# EAGLE board InkTime_Schematic (EAGLE 9.7.0)
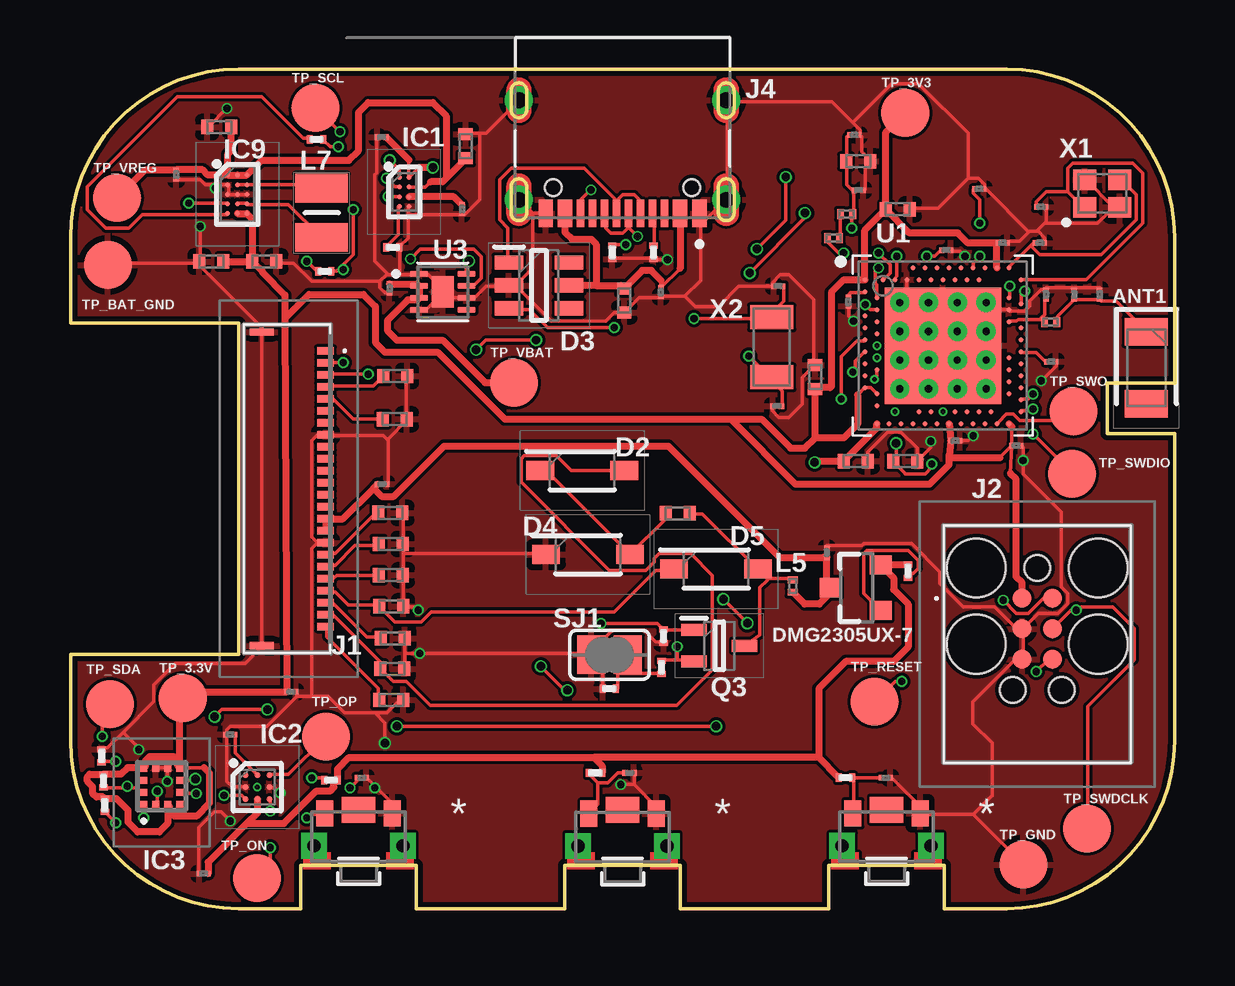
[diagram p2: board, top side]
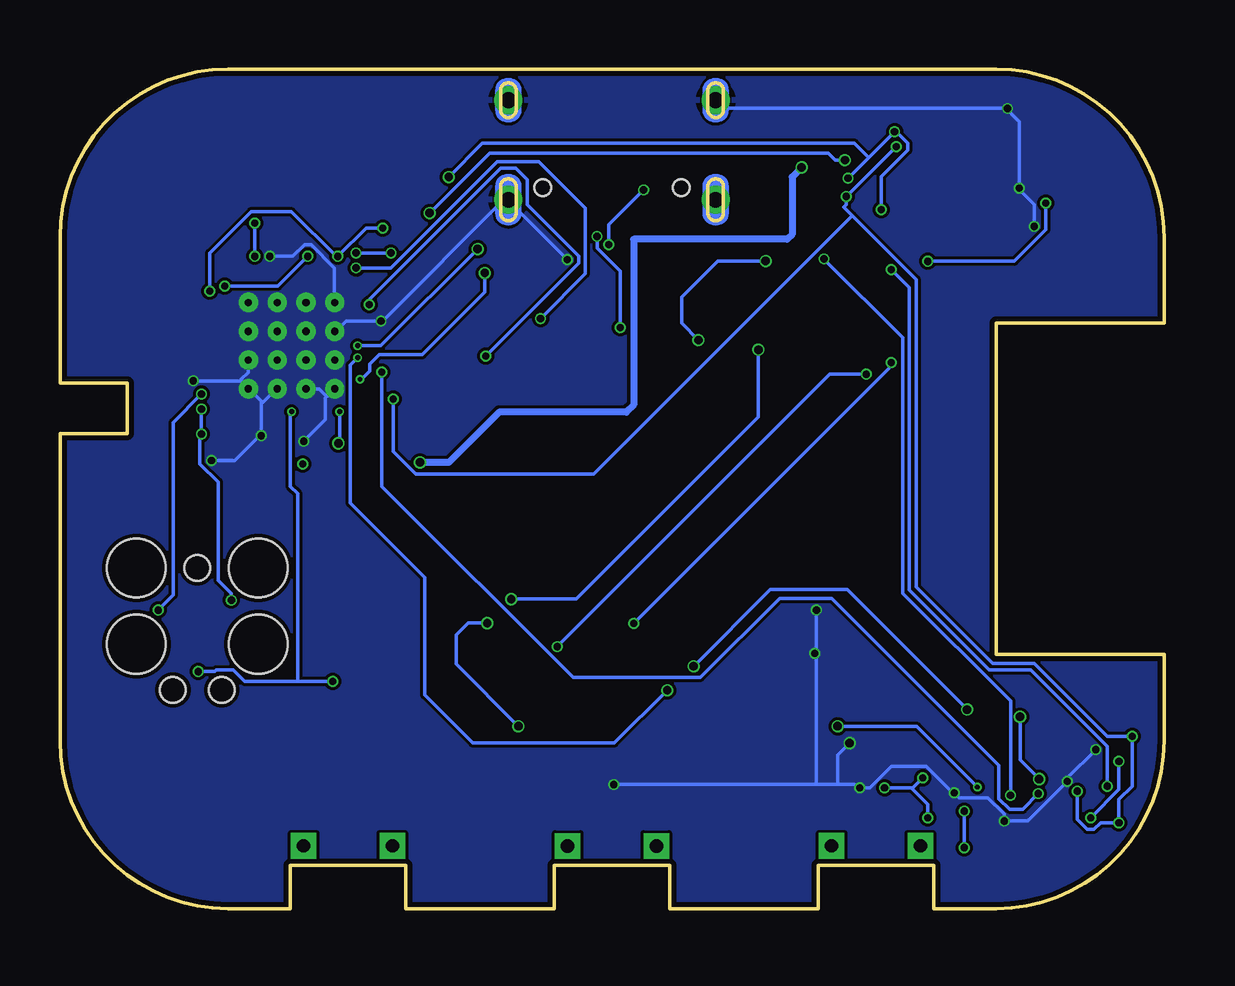
[diagram p3: board, bottom side, seen from below]

Size 46 x 35 mm. Coordinates in mm from the lower left corner, seen from the top.
Outline: 18.36,29 18.36,30.1 18.36,30.13 18.36,30.16 18.37,30.18 18.38,30.21 18.38,30.24 18.4,30.26 18.41,30.29 18.43,30.31 18.45,30.33 18.47,30.35 18.49,30.37 18.52,30.38 18.54,30.39 18.57,30.41 18.6,30.41 18.62,30.42 18.65,30.42 18.68,30.43 18.71,30.42 18.74,30.42 18.76,30.41 18.79,30.41 18.82,30.39 18.84,30.38 18.87,30.37 18.89,30.35 18.91,30.33 18.93,30.31 18.95,30.29 18.96,30.26 18.98,30.24 18.98,30.21 18.99,30.18 19,30.16 19,30.13 19,30.1 19,29 19,28.97 19,28.94 18.99,28.92 18.98,28.89 18.98,28.86 18.96,28.84 18.95,28.81 18.93,28.79 18.91,28.77 18.89,28.75 18.87,28.73 18.84,28.72 18.82,28.7 18.79,28.7 18.76,28.69 18.74,28.68 18.71,28.68 18.68,28.68 18.65,28.68 18.62,28.68 18.6,28.69 18.57,28.7 18.54,28.7 18.52,28.72 18.49,28.73 18.47,28.75 18.45,28.77 18.43,28.79 18.41,28.81 18.4,28.84 18.38,28.86 18.38,28.89 18.37,28.92 18.36,28.94 18.36,28.97 18.36,29
Outline: 27,33.3 27,34.1 27,34.13 27,34.16 27.01,34.18 27.02,34.21 27.02,34.24 27.04,34.26 27.05,34.29 27.07,34.31 27.09,34.33 27.11,34.35 27.13,34.37 27.16,34.38 27.18,34.39 27.21,34.41 27.24,34.41 27.26,34.42 27.29,34.42 27.32,34.42 27.35,34.42 27.38,34.42 27.4,34.41 27.43,34.41 27.46,34.39 27.48,34.38 27.51,34.37 27.53,34.35 27.55,34.33 27.57,34.31 27.59,34.29 27.6,34.26 27.62,34.24 27.62,34.21 27.63,34.18 27.64,34.16 27.64,34.13 27.64,34.1 27.64,33.3 27.64,33.27 27.64,33.24 27.63,33.22 27.62,33.19 27.62,33.16 27.6,33.14 27.59,33.11 27.57,33.09 27.55,33.07 27.53,33.05 27.51,33.03 27.48,33.02 27.46,33.01 27.43,32.99 27.4,32.99 27.38,32.98 27.35,32.98 27.32,32.98 27.29,32.98 27.26,32.98 27.24,32.99 27.21,32.99 27.18,33.01 27.16,33.02 27.13,33.03 27.11,33.05 27.09,33.07 27.07,33.09 27.05,33.11 27.04,33.14 27.02,33.16 27.02,33.19 27.01,33.22 27,33.24 27,33.27 27,33.3
Outline: 18.36,33.3 18.36,34.1 18.36,34.13 18.36,34.16 18.37,34.18 18.38,34.21 18.38,34.24 18.4,34.26 18.41,34.29 18.43,34.31 18.45,34.33 18.47,34.35 18.49,34.37 18.52,34.38 18.54,34.39 18.57,34.41 18.6,34.41 18.62,34.42 18.65,34.42 18.68,34.42 18.71,34.42 18.74,34.42 18.76,34.41 18.79,34.41 18.82,34.39 18.84,34.38 18.87,34.37 18.89,34.35 18.91,34.33 18.93,34.31 18.95,34.29 18.96,34.26 18.98,34.24 18.98,34.21 18.99,34.18 19,34.16 19,34.13 19,34.1 19,33.3 19,33.27 19,33.24 18.99,33.22 18.98,33.19 18.98,33.16 18.96,33.14 18.95,33.11 18.93,33.09 18.91,33.07 18.89,33.05 18.87,33.03 18.84,33.02 18.82,33.01 18.79,32.99 18.76,32.99 18.74,32.98 18.71,32.98 18.68,32.98 18.65,32.98 18.62,32.98 18.6,32.99 18.57,32.99 18.54,33.01 18.52,33.02 18.49,33.03 18.47,33.05 18.45,33.07 18.43,33.09 18.41,33.11 18.4,33.14 18.38,33.16 18.38,33.19 18.37,33.22 18.36,33.24 18.36,33.27 18.36,33.3
Outline: 27,29 27,30.1 27,30.13 27,30.16 27.01,30.18 27.02,30.21 27.02,30.24 27.04,30.26 27.05,30.29 27.07,30.31 27.09,30.33 27.11,30.35 27.13,30.37 27.16,30.38 27.18,30.39 27.21,30.41 27.24,30.41 27.26,30.42 27.29,30.42 27.32,30.43 27.35,30.42 27.38,30.42 27.4,30.41 27.43,30.41 27.46,30.39 27.48,30.38 27.51,30.37 27.53,30.35 27.55,30.33 27.57,30.31 27.59,30.29 27.6,30.26 27.62,30.24 27.62,30.21 27.63,30.18 27.64,30.16 27.64,30.13 27.64,30.1 27.64,29 27.64,28.97 27.64,28.94 27.63,28.92 27.62,28.89 27.62,28.86 27.6,28.84 27.59,28.81 27.57,28.79 27.55,28.77 27.53,28.75 27.51,28.73 27.48,28.72 27.46,28.7 27.43,28.7 27.4,28.69 27.38,28.68 27.35,28.68 27.32,28.68 27.29,28.68 27.26,28.68 27.24,28.69 27.21,28.7 27.18,28.7 27.16,28.72 27.13,28.73 27.11,28.75 27.09,28.77 27.07,28.79 27.05,28.81 27.04,28.84 27.02,28.86 27.02,28.89 27.01,28.92 27,28.94 27,28.97 27,29
Outline: 0,10.6 0,7 arc90 7,0 9.6,0 9.6,1.8 14.4,1.8 14.4,0 20.6,0 20.6,1.8 25.4,1.8 25.4,0 31.6,0 31.6,1.8 36.4,1.8 36.4,0 39,0 arc90 46,7 46,19.8 43.2,19.8 43.2,21.9 46,21.9 46,28 arc90 39,35 7,35 arc90 0,28 0,24.4 7,24.4 7,10.6 0,10.6
Copper layers (1*16): Top 0.035mm / dielectric 1.6mm / Bottom 0.035mm
Design rules "jlcpcb-2layers.dru *": minimum track width 5mil, minimum drill 0.3mm, track to track 5mil, track to pad 5mil, pad to pad 5mil, via to via 5mil, smd to smd 5mil, copper to edge 0.2mm, drill to drill 6mil, minimum pad ring 10mil, minimum via ring 3mil, stop-mask expansion 4mil, vias tented up to drill 0mil, thermal gap 10mil
Net classes: 0 default: width 0.15 mm; 1 traseedeputere: width 0.3 mm

## Footprints (pad centres in the part's own frame; a part is rotated, then mirrored left to right if it is on the bottom)
2450AT18B100E_ANTC3216X140N = smd 1.15 x 1.8: 1 -1.5,0; 2 1.5,0
GRM011R60J152KE01L_2_CAPC0201X13N = smd 0.22 x 0.23: 1 -0.185,0; 2 0.185,0
NORDIC_NRF_3_RESC0402_L = smd 0.5 x 0.6: 1 -0.5,0; 2 0.5,0
ESP32_C6_LIBRARY_5_SOD3716X135N = smd 1.15 x 0.8: 1 -1.75,0; 2 1.75,0
ESP32_C6_LIBRARY_3_SOT95P280X145-6N = smd 1.2 x 0.6: 1 -1.25,0.95; 2 -1.25,0; 3 -1.25,-0.95; 4 1.25,-0.95; 5 1.25,0; 6 1.25,0.95
ESP32_C6_LIBRARY_4_ESP32_C6_LIBRARY_4_ESP32_C6_LIBRARY_4_ESP32_C6_LIBRARY_4_ESP32_WROVER_SPARKFUN-DISCRETESEMI_SOT23-3 = smd 0.8 x 0.9: 1 -0.95,-1; 2 0.95,-1; 3 0,1.1
BQ25180YBGR_BGA8C40P2X4_100X155X50 = smd 0.2 x 0.2: A1 -0.2,0.6; A2 0.2,0.6; B1 -0.2,0.2; B2 0.2,0.2; C1 -0.2,-0.2; C2 0.2,-0.2; D1 -0.2,-0.6; D2 0.2,-0.6
DRV2605YZFR_BGA9C50P3X3_144X144X62 = smd 0.25 x 0.25: A1 -0.5,0.5; A2 0,0.5; A3 0.5,0.5; B1 -0.5,0; B2 0,0; B3 0.5,0; C1 -0.5,-0.5; C2 0,-0.5; C3 0.5,-0.5
BMA423_BMA423 = smd 0.3 x 0.35: 1 -0.75,-0.775; 2 -0.25,-0.775; 3 0.25,-0.775; 4 0.75,-0.775; 7 0.75,0.775; 8 0.25,0.775; 9 -0.25,0.775; 10 -0.75,0.775 | smd 0.35 x 0.3: 5 0.775,-0.25; 6 0.775,0.25; 11 -0.775,0.25; 12 -0.775,-0.25
RT6160AWSC_BGA15C40P3X5_140X230X60 = smd 0.216 x 0.216: A1 -0.4,0.8; A2 0,0.8; A3 0.4,0.8; B1 -0.4,0.4; B2 0,0.4; B3 0.4,0.4; C1 -0.4,0; C2 0,0; C3 0.4,0; D1 -0.4,-0.4; D2 0,-0.4; D3 0.4,-0.4; E1 -0.4,-0.8; E2 0,-0.8; E3 0.4,-0.8
503480-2400_5034802400 = smd 0.3 x 0.7: 1 -5.75,1.525; 2 -5.25,1.525; 3 -4.75,1.525; 4 -4.25,1.525; 5 -3.75,1.525; 6 -3.25,1.525; 7 -2.75,1.525; 8 -2.25,1.525; 9 -1.75,1.525; 10 -1.25,1.525; 11 -0.75,1.525; 12 -0.25,1.525; 13 0.25,1.525; 14 0.75,1.525; 15 1.25,1.525; 16 1.75,1.525; 17 2.25,1.525; 18 2.75,1.525; 19 3.25,1.525; 20 3.75,1.525; 21 4.25,1.525; 22 4.75,1.525; 23 5.25,1.525; 24 5.75,1.525 | smd 0.3 x 1: MP1 -6.54,-1.125; MP2 6.54,-1.125
TC2030-IDC_TC2030IDC = smd 0.783 x 0.783: 1 -0.953,-0.635; 2 -0.953,0.635; 3 0.317,-0.635; 4 0.317,0.635; 5 1.588,-0.635; 6 1.588,0.635 | hole 2.451: -2.223,-2.54; -2.223,2.54; 0.952,-2.54; 0.952,2.54 | hole 1.067: -2.223,0; 2.857,-1.016; 2.857,1.016
KH-TYPE-C-16P_KINGHELM_KH-TYPE-C-16P = smd 0.6 x 1.15: A1_B12 -3.2,4.725; A4_B9 -2.4,4.725; A9_B4 2.4,4.725; A12_B1 3.2,4.725 | smd 0.3 x 1.15: A5 -1.25,4.725; A6 -0.25,4.725; A7 0.25,4.725; A8 1.25,4.725; B5 1.75,4.725; B6 0.75,4.725; B7 -0.75,4.725; B8 -1.75,4.725 | drill 0.65 pad 1.05: SH1 -4.32,0; SH2 4.32,0; SH3 -4.32,4.15; SH4 4.32,4.15 | hole 0.7: -2.89,3.65; 2.89,3.65
NORDIC_NRF_2_RESC0201_L = smd 0.28 x 0.43: 1 -0.255,0; 2 0.255,0
MLP2016SR47MT0S1_INDC2016X100N = smd 1.2 x 2.2: 1 -1.028,0; 2 1.028,0
ESP32_C6_LIBRARY_6_SOT65P210X110-3N = smd 1.05 x 0.5: 1 -1.05,0.65; 2 -1.05,-0.65; 3 1.05,0
CPF0201D7K68C1_0201 = smd 0.35 x 0.25: 1 0,0.275; 2 0,-0.275
ESP32_C6_LIBRARY_7_JUMPER_SJ = smd 1.168 x 1.6: 1 -0.762,0; 2 0.762,0
2025-10-22_07-23-44_LIBRARY_SW_EVP-AKE31A_PAN = smd 0.711 x 1.092: 1 -1.4,-0.972; 2 1.4,-0.972 | drill 0.559 pad 0.914 square: 3 -1.848,0.381; 4 1.848,0.381 | smd 1.397 x 1.092: 5 0,-1.124
HECTOR_WATCH_1_TP20R = smd 2 x 2: TP 0,0
NORDIC_NRF_4_AQFN50P700X700X85_HS-74N = smd 4.85 x 4.85: P$74 0,0 | drill 0.3 pad 0.6: P$75 -1.8,1.8; P$76 -0.6,1.8; P$77 0.6,1.8; P$78 1.8,1.8; P$79 -1.8,0.6; P$80 -0.6,0.6; P$81 0.6,0.6; P$82 1.8,0.6; P$83 -1.8,-0.6; P$84 -0.6,-0.6; P$85 0.6,-0.6; P$86 1.8,-0.6; P$87 -1.8,-1.8; P$88 -0.6,-1.8; P$89 0.6,-1.8; P$90 1.8,-1.8 | smd 0.2 x 0.2: P$A8 -1.25,3.25; P$A10 -0.75,3.25; P$A12 -0.25,3.25; P$A14 0.25,3.25; P$A16 0.75,3.25; P$A18 1.25,3.25; P$A20 1.75,3.25; P$A22 2.25,3.25; P$A23 2.75,3.25; P$AA24 3.25,-2.25; P$AB2 -2.75,-2.5; P$AC5 -2,-2.75; P$AC9 -1,-2.75; P$AC11 -0.5,-2.75; P$AC13 0,-2.75; P$AC15 0.5,-2.75; P$AC17 1,-2.75; P$AC19 1.5,-2.75; P$AC21 2,-2.75; P$AC24 3.25,-2.75; P$AD2 -2.75,-3.25; P$AD4 -2.25,-3.25; P$AD6 -1.75,-3.25; P$AD8 -1.25,-3.25; P$AD10 -0.75,-3.25; P$AD12 -0.25,-3.25; P$AD14 0.25,-3.25; P$AD16 0.75,-3.25; P$AD18 1.25,-3.25; P$AD20 1.75,-3.25; P$AD22 2.25,-3.25; P$AD23 2.75,-3.25; P$B1 -3.25,2.75; P$B3 -2.5,2.75; P$B5 -2,2.75; P$B7 -1.5,2.75; P$B9 -1,2.75; P$B11 -0.5,2.75; P$B13 0,2.75; P$B15 0.5,2.75; P$B17 1,2.75; P$B19 1.5,2.75; P$B24 3.25,2.75; P$C1 -3.25,2.25; P$D2 -2.75,2; P$D23 2.75,2; P$E24 3.25,1.75; P$F2 -2.75,1.5; P$F23 2.75,1.5; P$G1 -3.25,1.25; P$H2 -2.75,1; P$H23 2.75,1; P$J1 -3.25,0.75; P$J24 3.25,0.75; P$K2 -2.75,0.5; P$L1 -3.25,0.25; P$L24 3.25,0.25; P$M2 -2.75,0; P$N1 -3.25,-0.25; P$N24 3.25,-0.25; P$P2 -2.75,-0.5; P$P23 2.75,-0.5; P$R1 -3.25,-0.75; P$R24 3.25,-0.75; P$T2 -2.75,-1; P$T23 2.75,-1; P$U1 -3.25,-1.25; P$U24 3.25,-1.25; P$V23 2.75,-1.5; P$W1 -3.25,-1.75; P$W24 3.25,-1.75; P$Y2 -2.75,-2; P$Y23 2.75,-2
ESP32_C6_LIBRARY_SON50P200X200X80-9N = smd 0.76 x 0.27: 1 -0.985,0.75; 2 -0.985,0.25; 3 -0.985,-0.25; 4 -0.985,-0.75; 5 0.985,-0.75; 6 0.985,-0.25; 7 0.985,0.25; 8 0.985,0.75 | smd 0.9 x 1.3: 9 0,0
NORDIC_NRF_BT-XTAL_2016_N = smd 0.95 x 0.85: 1 -0.725,-0.575; 2 0.725,-0.575; 3 0.725,0.575; 4 -0.725,0.575
NORDIC_NRF_1_XTAL_3215_N = smd 1 x 1.8: 1 -1.25,0; 2 1.25,0

## Placement (x,y rotation side)
ANT1  2450AT18B100E  [2450AT18B100E_ANTC3216X140N]  44.82,22.55 270 top
C1  12pF  [GRM011R60J152KE01L_2_CAPC0201X13N]  40.44,29.25 0 top
C1-EP-DR  10uF  [GRM011R60J152KE01L_2_CAPC0201X13N]  31.51,14.84 90 top
C2  12pF  [GRM011R60J152KE01L_2_CAPC0201X13N]  40.39,27.75 0 top
C2-EP-DR  4.7uF/25V  [NORDIC_NRF_3_RESC0402_L]  25.3,16.48 0 top
C3  1pF  [GRM011R60J152KE01L_2_CAPC0201X13N]  40.64,25.6 90 top
C4  1pF  [GRM011R60J152KE01L_2_CAPC0201X13N]  41.82,25.6 90 top
C5  100nF  [GRM011R60J152KE01L_2_CAPC0201X13N]  32.41,25.3 270 top
C6  4.7uF  [NORDIC_NRF_3_RESC0402_L]  31.02,22.15 90 top
C7  100nF  [GRM011R60J152KE01L_2_CAPC0201X13N]  36.86,19.5 0 top
C8  100nF  [GRM011R60J152KE01L_2_CAPC0201X13N]  39.41,19.3 0 top
C9  820pF  [GRM011R60J152KE01L_2_CAPC0201X13N]  40.86,22.8 0 top
C10  N.C.  [GRM011R60J152KE01L_2_CAPC0201X13N]  32.66,32.25 0 top
C11  100pF  [GRM011R60J152KE01L_2_CAPC0201X13N]  36.49,27.45 0 top
C12  100nF  [GRM011R60J152KE01L_2_CAPC0201X13N]  38.84,27.75 0 top
C13  N.C.  [GRM011R60J152KE01L_2_CAPC0201X13N]  37.86,30 0 top
C14  4.7uF  [NORDIC_NRF_3_RESC0402_L]  34.47,29.15 0 top
C15  1.0uF  [NORDIC_NRF_3_RESC0402_L]  32.82,31.15 0 top
C16  47nF  [GRM011R60J152KE01L_2_CAPC0201X13N]  32.84,29.95 0 top
C17  12pF  [GRM011R60J152KE01L_2_CAPC0201X13N]  29.49,25.95 0 top
C18  12pF  [GRM011R60J152KE01L_2_CAPC0201X13N]  29.44,20.95 0 top
C19  100nF  [GRM011R60J152KE01L_2_CAPC0201X13N]  9.19,9.04 0 top
C20  4.7uF  [NORDIC_NRF_3_RESC0402_L]  34.77,18.65 0 top
C21  4.7uF  [NORDIC_NRF_3_RESC0402_L]  32.72,18.65 0 top
C22  N.C.  [GRM011R60J152KE01L_2_CAPC0201X13N]  42.88,25.6 90 top
C23  0.1uF  [GRM011R60J152KE01L_2_CAPC0201X13N]  4.4,30.6 90 top
C24  10uF  [NORDIC_NRF_3_RESC0402_L]  6.19,32.58 0 top
C25  22uF  [NORDIC_NRF_3_RESC0402_L]  8.08,26.98 0 top
C27  0.1uF  [GRM011R60J152KE01L_2_CAPC0201X13N]  13.29,25.86 90 top
C29  1uF  [GRM011R60J152KE01L_2_CAPC0201X13N]  33.97,5.46 180 top
C30  1uF  [GRM011R60J152KE01L_2_CAPC0201X13N]  12.13,5.46 180 top
C31  1uF  [GRM011R60J152KE01L_2_CAPC0201X13N]  23.29,5.66 180 top
C32  1uF  [GRM011R60J152KE01L_2_CAPC0201X13N]  6.65,7.26 0 top
C33  22uF  [NORDIC_NRF_3_RESC0402_L]  5.87,26.98 180 top
C34  0.1uF  [GRM011R60J152KE01L_2_CAPC0201X13N]  5.55,1.46 0 top
C37  1uF  [GRM011R60J152KE01L_2_CAPC0201X13N]  16.31,29.16 90 top
C38  1uF  [GRM011R60J152KE01L_2_CAPC0201X13N]  12.97,32.16 0 top
C39  10uF  [NORDIC_NRF_3_RESC0402_L]  16.46,31.78 90 top
C42  0.1uF  [GRM011R60J152KE01L_2_CAPC0201X13N]  24.6,25.7 270 top
C43  4.7uF  [NORDIC_NRF_3_RESC0402_L]  23.07,25.35 270 top
D2  MBR0530  [ESP32_C6_LIBRARY_5_SOD3716X135N]  21.32,18.26 0 top
D3  USBLC6-2SC6Y  [ESP32_C6_LIBRARY_3_SOT95P280X145-6N]  19.52,25.98 0 top
D4  MBR0530  [ESP32_C6_LIBRARY_5_SOD3716X135N]  21.56,14.76 0 top
D5  MBR0530  [ESP32_C6_LIBRARY_5_SOD3716X135N]  26.9,14.16 0 top
DMG2305UX-7  20V/4.2A/52mΩ/1.4W  [ESP32_C6_LIBRARY_4_ESP32_C6_LIBRARY_4_ESP32_C6_LIBRARY_4_ESP32_C6_LIBRARY_4_ESP32_WROVER_SPARKFUN-DISCRETESEMI_SOT23-3]  32.76,13.38 90 top
EPD_C1  1uF/50V  [NORDIC_NRF_3_RESC0402_L]  13.51,20.4 180 top
EPD_C2  1uF/50V  [NORDIC_NRF_3_RESC0402_L]  13.52,22.2 180 top
EPD_C5  0.1uF/50V  [GRM011R60J152KE01L_2_CAPC0201X13N]  12.98,17.7 180 top
EPD_C6  1uF/50V  [NORDIC_NRF_3_RESC0402_L]  13.33,16.5 180 top
EPD_C7  1uF/50V  [NORDIC_NRF_3_RESC0402_L]  13.34,15.2 180 top
EPD_C8  1uF/50V  [NORDIC_NRF_3_RESC0402_L]  13.35,13.9 180 top
EPD_C9  1uF/50V  [NORDIC_NRF_3_RESC0402_L]  13.36,12.6 180 top
EPD_C10  1uF/50V  [NORDIC_NRF_3_RESC0402_L]  13.42,11.27 180 top
EPD_C11  1uF/50V  [NORDIC_NRF_3_RESC0402_L]  13.4,10 180 top
EPD_C12  1uF/50V  [NORDIC_NRF_3_RESC0402_L]  13.36,8.7 180 top
IC1  BQ25180YBGR  [BQ25180YBGR_BGA8C40P2X4_100X155X50]  13.9,29.88 0 top
IC2  DRV2605YZFR  [DRV2605YZFR_BGA9C50P3X3_144X144X62]  7.78,5.07 0 top
IC3  BMA421  [BMA423_BMA423]  3.8,5.1 0 top
IC9  RT6160AWSC  [RT6160AWSC_BGA15C40P3X5_140X230X60]  6.95,29.78 0 top
J1  503480-2400  [503480-2400_5034802400]  9.1,17.5 270 top
J2  TC2030-IDC  [TC2030-IDC_TC2030IDC]  40.28,11.98 270 top
J4  KH-TYPE-C-16P  [KH-TYPE-C-16P_KINGHELM_KH-TYPE-C-16P]  23,33.7 180 top
L1  3.9nH  [NORDIC_NRF_2_RESC0201_L]  40.84,24.45 0 top
L2  10uH  [NORDIC_NRF_2_RESC0201_L]  31.79,27.95 0 top
L3  15nH  [NORDIC_NRF_2_RESC0201_L]  32.34,28.95 0 top
L5  68uH  [NORDIC_NRF_2_RESC0201_L]  30.09,13.45 90 top
L7  FTC252012SR47MBCA  [MLP2016SR47MT0S1_INDC2016X100N]  10.46,29.01 270 top
Q3  SI1308EDL-T1-GE3  [ESP32_C6_LIBRARY_6_SOT65P210X110-3N]  27.03,10.96 0 top
R1_EP_DR  0.47  [CPF0201D7K68C1_0201]  24.63,10.06 180 top
R1_USB  5K1  [CPF0201D7K68C1_0201]  24.29,27.36 180 top
R2  0  [CPF0201D7K68C1_0201]  10.25,32.06 270 top
R2_EP_DR  10K  [CPF0201D7K68C1_0201]  24.71,11.36 180 top
R2_USB  5K1  [CPF0201D7K68C1_0201]  22.57,27.36 0 top
R3  0  [CPF0201D7K68C1_0201]  1.3,6.37 0 top
R4  0  [CPF0201D7K68C1_0201]  10.59,26.56 270 top
R5  10K  [CPF0201D7K68C1_0201]  10.85,5.36 90 top
R7  10K  [CPF0201D7K68C1_0201]  32.29,5.46 270 top
R8  10K  [CPF0201D7K68C1_0201]  21.87,5.66 90 top
R9  10K  [CPF0201D7K68C1_0201]  13.43,27.56 270 top
R17  3K3  [CPF0201D7K68C1_0201]  1.37,5.33 0 top
R18  3K3  [CPF0201D7K68C1_0201]  1.43,4.3 0 top
R_PWR_EPD  10K  [CPF0201D7K68C1_0201]  34.89,14.07 180 top
R_TYPE_SEL  2.2  [CPF0201D7K68C1_0201]  22.45,9.17 90 top
SJ1  [ESP32_C6_LIBRARY_7_JUMPER_SJ]  22.46,10.58 0 top
SW_DN  2025-10-22_07-23-44_LIBRARY_EVP-AKE31ASW_EVP-AKE31A_PAN  [2025-10-22_07-23-44_LIBRARY_SW_EVP-AKE31A_PAN]  34,3 180 top
SW_ENT  2025-10-22_07-23-44_LIBRARY_EVP-AKE31ASW_EVP-AKE31A_PAN  [2025-10-22_07-23-44_LIBRARY_SW_EVP-AKE31A_PAN]  23,2.99 180 top
SW_UP  2025-10-22_07-23-44_LIBRARY_EVP-AKE31ASW_EVP-AKE31A_PAN  [2025-10-22_07-23-44_LIBRARY_SW_EVP-AKE31A_PAN]  12,3 180 top
TP_3.3V  HECTOR_WATCH_1_TPTP20R  [HECTOR_WATCH_1_TP20R]  4.68,8.78 0 top
TP_3V3  HECTOR_WATCH_1_TPTP20R  [HECTOR_WATCH_1_TP20R]  34.78,33.18 0 top
TP_BAT_GND  HECTOR_WATCH_1_TPTP20R  [HECTOR_WATCH_1_TP20R]  1.56,26.83 0 top
TP_GND  HECTOR_WATCH_1_TPTP20R  [HECTOR_WATCH_1_TP20R]  39.7,1.83 0 top
TP_ON  HECTOR_WATCH_1_TPTP20R  [HECTOR_WATCH_1_TP20R]  7.76,1.28 0 top
TP_OP  HECTOR_WATCH_1_TPTP20R  [HECTOR_WATCH_1_TP20R]  10.64,7.18 0 top
TP_RESET  HECTOR_WATCH_1_TPTP20R  [HECTOR_WATCH_1_TP20R]  33.5,8.63 0 top
TP_SCL  HECTOR_WATCH_1_TPTP20R  [HECTOR_WATCH_1_TP20R]  10.2,33.38 0 top
TP_SDA  HECTOR_WATCH_1_TPTP20R  [HECTOR_WATCH_1_TP20R]  1.64,8.52 0 top
TP_SWDCLK  HECTOR_WATCH_1_TPTP20R  [HECTOR_WATCH_1_TP20R]  42.36,3.33 0 top
TP_SWDIO  HECTOR_WATCH_1_TPTP20R  [HECTOR_WATCH_1_TP20R]  41.73,18.13 0 top
TP_SWO  HECTOR_WATCH_1_TPTP20R  [HECTOR_WATCH_1_TP20R]  41.79,20.73 0 top
TP_VBAT  HECTOR_WATCH_1_TPTP20R  [HECTOR_WATCH_1_TP20R]  18.48,21.93 0 top
TP_VREG  HECTOR_WATCH_1_TPTP20R  [HECTOR_WATCH_1_TP20R]  1.94,29.63 0 top
U1  NRF52840_QF  [NORDIC_NRF_4_AQFN50P700X700X85_HS-74N]  36.35,23.47 0 top
U3  MAX17048G+T10  [ESP32_C6_LIBRARY_SON50P200X200X80-9N]  15.51,25.71 0 top
X1  32MHz  [NORDIC_NRF_BT-XTAL_2016_N]  42.99,29.81 0 top
X2  32.768kHz  [NORDIC_NRF_1_XTAL_3215_N]  29.22,23.41 270 top

## Tracks (layer width: path | path; a pad name or v marks a point on that pad's centre or on a via)
3V3/1.7D
  Top 0.3: IC2.C2 7.78,3.98 7.35,3.55 | 7.35,3.55 5.73,1.94 C34.2 | 21.8,6.3 11.6,6.3 11.12,5.82 R5.2 10.98,5.21 10.98,5.07 10.81,4.91 10.24,4.91 8.88,3.55 7.35,3.55 | 21.8,6.3 22.14,5.96 R8.2 | R7.2 31.18,6.3 | 31.18,6.3 21.8,6.3 | R_PWR_EPD.2 33.77,14.35 DMG2305UX-7.2 34.3,13.79 34.3,13.3 34.9,12.7 34.9,10.9 34.3,10.3 32.3,10.3 31.18,9.18 31.18,6.3
3V3/2.4A
  Top 0.127: U1.P$AD14
  Top 0.15: 38.6,27.73 C12.1 | 39.16,18.14 C8.1 | U1.P$Y2 33.35,21.72 U1.P$W1 32.8,21.42 | 5.57,5.88 IC3.7 | 38.73,18.8 C8.1 | 39.23,20.09 C8.1
  Top 0.3: C25.1 7.58,28.75 IC9.E3 IC9.E2 | C33.1 C25.1 | C14.1 33.1,28.28 U1.P$B1 32.22,26.22 31.7,25.7 31.7,21.77 31.65,21.72 31.09,21.72 C6.1 31.02,19.62 | U1.P$A22 38.6,27.73 | C12.1 37.39,27.75 36.97,28.17 34.95,28.17 C14.1 | C14.1 33.97,32.37 TP_3V3.TP | J2.1 39.64,13.59 39.4,13.84 39.4,17.9 39.16,18.14 | U1.P$AD14 C7.1 36.61,18.89 | 36.61,18.89 36.7,18.8 38.73,18.8 | C25.1 8,26.56 8,26.52 8.94,25.58 8.94,24.6 | 8.94,24.6 C19.1 4.93,9.04 TP_3.3V.TP 4.55,8.65 IC3.7 4.48,5.95 4.48,6.16 4.32,6.33 3.29,6.33 3.12,6.16 3.12,5.95 IC3.10 2.38,5.88 2.1,5.6 R17.1 | R17.1 | R17.1 0.8,5.6 0.7,5.5 0.7,5.31 0.92,5.08 0.92,4.81 1.08,4.65 1.35,4.65 R18.1 1.92,4.58 2.4,4.1 2.4,3.6 2.8,3.2 3.7,3.2 4.05,3.55 IC3.3 4.12,4.25 4.12,4.04 4.29,3.87 5.27,3.87 5.8,4.4 5.8,5.64 5.57,5.88 | 27.5,20.4 18.1,20.4 15.3,23.2 13.1,23.2 12.7,23.6 12.7,25.1 12.2,25.6 9.94,25.6 8.94,24.6 | 27.5,20.4 28.8,20.4 30,19.2 30.6,19.2 31.02,19.62 | 27.5,20.4 30.2,17.7 35.8,17.7 36.61,18.5 36.61,18.89 | 32.8,21.42 32.8,20.2 32.22,19.62 31.02,19.62 | U1.P$AD23 39.23,20.09
DEC1
  Top 0.15: U1.P$C1 33.04,25.67 32.49,25.67 32.42,25.6 C5.1
DEC3  (via drill 0.3)
  Top 0.15: v39.14,25.95 39.14,25.53 U1.P$D23 | v35.67,27.2 36.02,27.2 36.23,27.4 C11.1
  Bottom 0.15: v39.14,25.95 36.92,25.95 v35.67,27.2
DEC4_6  (via drill 0.3)
  Top 0.15: C10.1 32.35,32.18 32.35,31.21 C15.1 32.35,31.14 32.35,30.17 32.56,29.96 C16.1 32.63,29.9 32.63,28.99 L3.2 32.56,28.93 v32.56,28.37 | v34.43,27.2 34.43,26.36 34.36,26.3 U1.P$B5 | v39.76,25.74 39.62,25.6 39.62,25.26 U1.P$E24
  Bottom 0.15: v32.56,28.37 33.25,28.37 v34.43,27.2 34.49,27.2 36.37,29.06 38.03,29.06 39.76,27.33 v39.76,25.74
DN
  Top 0.15: J4.B7 23.69,28.99 23.69,29.55 23.48,29.76 23,29.76 22.79,29.55 22.79,28.99 J4.A7 22.72,29.55 21.41,30.87 18.36,30.87 17.88,30.38 17.88,28.72 18.22,28.37 18.22,26.99 D3.1
DP  (via drill 0.3)
  Top 0.15: 23.21,28.37 23,28.16 22.52,28.16 22.31,28.37 22.31,28.93 J4.B6 | 23.21,28.37 23.21,28.93 J4.A6 | v22.65,24.22 19.88,24.22 19.12,24.98 18.29,24.98 D3.3 | v23.62,28.03 23.28,28.37 23.21,28.37
  Bottom 0.15: v22.65,24.22 22.65,26.57 23.62,27.54 v23.62,28.03
EPD_3V3
  Top 0.3: 12.62,17.52 11.35,16.25 J1.15 J1.16 | 12.62,17.52 12.72,17.62 EPD_C5.2 | L5.1 30.59,12.7 31.2,12.7 31.66,13.16 DMG2305UX-7.3 31.51,13.53 C1-EP-DR.1 31.38,14.64 29.54,14.64 24.91,19.28 15.57,19.28 13.47,17.18 12.97,17.18 12.62,17.52
GDR  (via drill 0.3)
  Top 0.15: Q3.1 24.73,11.61 R2_EP_DR.2 24.45,11.89 v22.1,11.89 | v11.37,22.76 10.67,22.76 J1.2
  Bottom 0.15: v11.37,22.76 11.37,22.62 v22.1,11.89
GND  (via drill 0.3, 0.35)
  Top 0.15: 2.19,7.36 3.47,8.64 3.47,9.33 4.37,10.23 7.28,10.23 7.97,10.92 J1.MP2 7.97,10.99 7.97,24.01 J1.MP1 7.97,24.08 7.97,24.22 5.34,26.85 C33.2 | 2.19,7.36 1.53,6.7 1.32,6.7 R3.1 | C33.2 5.34,26.92 1.67,26.92 1.6,26.85 TP_BAT_GND.TP | 13.93,10.64 EPD_C10.1 | 13.93,10.64 13.93,10.02 EPD_C11.1 | R_TYPE_SEL.1 22.17,9.19 22.17,10.16 21.75,10.57 SJ1.1 | R2_EP_DR.1 24.66,11.13 24.39,11.13 23.9,11.61 22.59,11.61 21.75,10.78 21.75,10.64 SJ1.1 | 13.93,10.64 v14.55,10.64 21.68,10.64 SJ1.1 | 10.26,15.28 10.6,15.28 J1.17 | 10.26,15.28 10.05,15.49 10.05,19.51 10.26,19.72 10.6,19.72 J1.8 10.67,19.72 13.03,19.72 13.17,19.58 13.24,19.58 | 13.24,19.58 13.24,17.71 EPD_C5.1 | 13.24,19.58 14,20.34 EPD_C1.1 14,20.48 14,22.14 EPD_C2.1 | 13.86,14.8 13.86,15.15 EPD_C7.1 13.86,15.21 13.86,16.46 EPD_C6.1 | 13.86,14.8 13.86,13.97 EPD_C8.1 13.86,13.83 13.86,12.65 EPD_C9.1 13.93,12.58 14.34,12.58 v14.48,12.45 | 13.86,14.8 19.75,14.8 D4.1 | 23.48,5.17 23.48,5.66 C31.1 | 23.48,5.17 24.39,4.27 24.39,4 SW_ENT.1 | 12.72,5.07 13.37,4.41 13.37,4 SW_UP.1 | 12.72,5.07 12.34,5.45 C30.1 | IC3.9 3.61,5.87 4.03,5.87 IC3.8 4.03,5.8 v4.03,5.31 | C34.1 5.34,1.5 5.34,3.39 5.98,4.03 6.28,4.03 v6.66,3.65 | v8.73,4.83 8.53,5.04 8.32,5.04 IC2.B3 | 12.7,8.15 11.44,8.15 10.74,8.84 10.05,8.84 | 12.7,8.15 13.17,8.15 13.65,8.64 13.86,8.64 EPD_C12.1 | 10.05,8.84 9.5,8.84 C19.2 9.43,8.98 9.43,8.84 8.18,7.6 6.66,7.6 6.52,7.46 6.52,7.32 C32.1 6.52,7.25 6.52,5.31 6.76,5.07 IC2.B1 | v12.68,5.04 12.72,5.07 | v22.93,5.17 23.48,5.17 | 10.05,8.84 10.05,15.01 10.26,15.21 10.26,15.28 | 2.19,7.36 2.85,6.7 v2.85,6.63 | C29.1 34.22,5.45 35.4,4.27 35.4,4 SW_DN.1 35.47,3.93 37.61,3.93
  Top 0.15: 37.61,3.93 39.69,1.85 TP_GND.TP | C1-EP-DR.2 31.52,15.15 32.97,15.15 33.04,15.21 35.05,15.21 36.23,14.04 36.23,13.55 37.2,12.58 38.51,12.58 39.41,11.68 39.62,11.68 J2.3 | C8.2 39.69,19.23 v39.69,18.68 39.69,18.12 41.28,16.53 41.28,13.41 41.56,13.14 41.56,12.72 41.14,12.31 40.31,12.31 39.69,11.68 J2.3 | J2.3 39.69,11.61 39.69,10.44 J2.5 39.62,10.37 39.34,10.37 37.6,8.62 37.6,7.7 38.4,6.9 38.4,4.7 38.38,4.7 37.61,3.93 | IC9.C3 7.35,29.76 7,29.76 IC9.C2 6.93,29.76 6.59,29.76 IC9.C1 6.59,29.83 6.59,30.17 IC9.B1 6.52,30.17 6.03,30.17 | 6.03,30.17 5.62,30.17 5.41,30.38 4.44,30.38 C23.1 | 17.05,32.32 17.32,32.32 18.64,33.64 J4.SH2 | 17.05,32.32 16.49,32.32 C39.2 | v6.52,33.36 5.76,32.6 C24.1 | v6.03,30.03 6.03,30.17 | 19.26,28.99 19.75,28.99 J4.A12_B1 | 19.26,28.99 18.71,29.55 J4.SH4 | U3.4 14.55,24.98 14.83,24.98 15.52,25.67 U3.9 | U3.9 15.59,25.67 15.8,25.46 U3.6 16.56,25.46 16.84,25.46 17.32,25.95 18.22,25.95 D3.2 | 19.26,28.99 19.26,26.71 18.57,26.02 18.29,26.02 D3.2 | 14.07,28.93 14.07,27.96 13.72,27.61 R9.1 13.72,27.54 13.72,26.43 | 14.07,28.93 14.07,29.27 IC1.D2 | 14.07,28.93 16.28,28.93 C37.1 16.35,28.93 16.42,28.93 17.05,29.55 17.05,32.32 | 12.89,26.16 12.89,25.88 13.1,25.67 13.24,25.67 C27.1 | 13.17,26.43 12.89,26.16 | 13.72,26.43 14.48,26.43 U3.1 14.55,26.43 14.9,26.43 15.45,25.88 15.45,25.74 U3.9 | 13.72,26.43 13.17,26.43 | C38.1 12.75,32.11 12.75,30.66 12.68,30.59 12.68,26.99 13.17,26.5 13.17,26.43 | 12.89,26.16 10.05,26.16 9.29,26.92 8.6,26.92 C25.2 | v37.61,19.72 37.4,19.51 37.13,19.51 C7.2 | v40.45,22 41.07,22.62 41.07,22.76 C9.2 | C21.2 33.22,19.04 34.04,19.86 34.6,19.86 35.27,19.19 C20.2 35.84,19.22 v35.84,19.48
  Top 0.15: v37.27,27.2 37.06,27.4 36.78,27.4 C11.2 | v32.63,24.49 32.42,24.7 32.42,24.98 C5.2 | C22.2 42.88,25.88 41.84,25.88 C4.2 41.77,25.88 40.66,25.88 C3.2 40.59,25.81 40.45,25.81 39.97,25.32 39.97,25.12 39.76,24.91 39.14,24.91 U1.P$F23 39.07,24.98 38.44,24.98 38.17,25.26 U1.P$74 | 34.56,25.32 34.84,25.6 34.84,26.16 U1.P$B7 | U1.P$83 34.56,22.9 34.56,24.01 U1.P$74 | U1.P$74 35.74,23.59 35.74,22.9 U1.P$84 35.74,22.83 35.74,21.72 U1.P$88 | U1.P$85 36.92,22.9 36.37,23.45 U1.P$74 | U1.P$80 U1.P$74 | U1.P$81 36.99,24.08 U1.P$74 | U1.P$76 35.74,25.26 35.19,24.7 U1.P$74 | U1.P$77 36.99,25.26 37.54,24.7 U1.P$74 | U1.P$74 37.54,24.63 38.1,24.08 U1.P$82 38.17,24.01 38.17,22.9 U1.P$86 | U1.P$78 38.17,25.32 U1.P$74 | U1.P$79 34.56,24.08 U1.P$74 | 34.56,25.32 U1.P$75 | 34.56,25.32 U1.P$74 | X1.4 42.32,30.38 43.43,29.27 43.71,29.27 X1.2 43.43,29.2 42.8,28.58 40.66,28.58 40.66,28.65 | 39.93,28.2 39.97,28.23 40.31,28.23 | 39.93,28.2 39.55,27.82 39.14,27.82 C12.2 | 40.31,28.23 40.59,27.96 40.59,27.82 C2.2 | 39.93,28.2 38.17,29.96 C13.2 38.1,30.03 38.1,30.17 37.82,30.45 37.4,30.45 | 40.66,28.65 40.66,29.2 C1.2 | 40.66,28.65 40.31,28.3 40.31,28.23 | 37.4,30.45 36.16,29.2 34.98,29.2 C14.2 | C16.2 33.11,29.96 33.11,30.93 C15.2 33.32,31.21 32.97,31.56 32.97,32.18 C10.2 32.9,32.32 32.9,32.46 32.59,32.77 | 32.59,32.77 31.73,33.64 27.36,33.64 J4.SH1 27.36,33.57 27.36,29.62 J4.SH3 27.29,29.55 26.5,28.75 26.25,28.99 J4.A1_B12 26.26,28.92 26.26,26.19 25.6,25.53 | R2_USB.2 22.59,27.13 24.25,27.13 R1_USB.1 24.32,27.06 v24.87,27.06 | C18.1 29.23,20.89 29.23,20.75 29.51,20.48 29.93,20.48 30.48,21.03 30.48,22.14 30.96,22.62 C6.2 30.96,22.69 30.96,25.39 29.93,26.43 29.58,26.43 29.23,26.09 C17.1 27.85,25.95 27,25.1 26.03,25.1 25.6,25.53
  Top 0.15: 25.6,25.53 24.66,25.53 C42.2 24.59,25.46 23.69,25.46 23.14,24.91 C43.2 23,24.84 22.65,24.84 22.31,24.49 20.02,24.49 18.57,25.95 D3.2 | 37.4,30.45 37.4,32.32 35.33,34.4 34.22,34.4 32.59,32.77 | v5.41,28.44 5.41,26.99 C33.2 | 12.7,8.15 13.1,7.75 v13.1,6.9
  Bottom 0.15: 13.6,5.17 12.89,5.17 12.75,5.04 v12.68,5.04 12.27,5.04 11.37,5.94 9.91,5.94 8.8,4.83 v8.73,4.83 8.53,4.63 7.34,4.63 6.66,3.94 v6.66,3.65 5.69,3.65 v4.03,5.31 4.03,5.45 v2.85,6.63 | 13.6,5.17 14.48,5.17 | 14.48,5.17 v22.93,5.17 | 14.48,5.17 14.48,10.64 | 14.48,10.64 v14.48,12.45 | v14.55,10.64 14.48,10.64 | J4.SH2 18.64,33.64 18.36,33.36 v6.52,33.36 6.52,33.29 6.03,32.8 v6.03,30.03 6.03,29.96 5.41,29.34 v5.41,28.44 | 37.61,21.1 37.61,21.17 38.1,21.66 U1.P$90 38.17,21.72 38.44,22 | 37.61,21.1 v37.61,19.72 37.68,19.72 38.72,18.68 v39.69,18.68 | 38.44,22 v40.45,22 | U1.P$89 36.99,21.66 37.54,21.1 37.61,21.1 | U1.P$86 38.17,22.83 38.17,22.35 38.44,22.07 38.44,22 | v35.84,19.48 34.94,20.38 34.94,21.28 34.84,21.38 | 34.84,21.38 34.56,21.66 U1.P$87 | U1.P$88 35.74,21.66 35.19,21.66 34.91,21.38 34.84,21.38 | v37.27,27.2 36.3,27.2 35.81,27.68 35.53,27.68 34.56,26.71 34.56,25.32 U1.P$75 | U1.P$79 34.49,24.08 34.08,24.49 v32.63,24.49 32.56,24.49 27.5,29.55 27.43,29.55 J4.SH3 27.36,29.55 v24.87,27.06 | v13.1,6.9 13.6,6.4 13.6,5.17
  pour Top: -3.82,-1.82 49.92,-1.82 49.92,36.92 -3.82,36.92
  pour Bottom: -3.82,-1.82 49.92,-1.82 49.92,36.92 -3.82,36.92
IMU_INT1  (via drill 0.3)
  Top 0.15: U1.P$N1 32.7,22.82 32.7,22.48 v32.59,22.37 | v5.23,4.8 4.63,4.8 IC3.5
  Bottom 0.15: v32.59,22.37 32.59,17.61 24.62,9.64 19.31,9.64 16.02,12.93 13.84,12.93 6.88,5.97 6.88,4.58 6.43,4.13 5.89,4.13 v5.23,4.8
IMU_INT2  (via drill 0.2, 0.35)
  Top 0.15: IC3.6 5.15,5.35 v5.2,5.4 | v6,8 6.3,8.3 v8.2,8.3 | v19.6,10.1 20.6,9.1 v20.7,9.1
  Bottom 0.15: v5.2,5.4 6,6.2 v6,8 | v8.2,8.3 13.2,13.3 16.4,13.3 v19.6,10.1 | v20.7,9.1 22.9,6.9 28.8,6.9 30.8,8.9 30.8,13.8 33.9,16.9 33.9,22.67 U1.P$P2
  other vias: 33.6,22.97
LX1
  Top 0.15: IC9.B2 7,30.17 IC9.B3 7.42,30.17 10.33,30.17 10.4,30.1 L7.1
LX2
  Top 0.15: IC9.D2 7,29.41 7.35,29.41 IC9.D3 7.42,29.34 9.08,29.34 10.4,28.03 L7.2
N$1
  Top 0.15: C32.2 6.86,7.25 6.86,6.49 7.77,5.59 IC2.A2
N$2
  Top 0.15: IC1.D1 13.65,29.27 13.65,28.09 13.17,27.61 R9.2
N$3
  Top 0.15: 29.02,13.76 30.06,13.76 L5.2 | 29.02,13.76 28.68,14.11 D5.2 28.61,14.18 26.32,16.46 25.84,16.46 C2-EP-DR.2 | Q3.3 28.72,11.4 28.72,13.39 29.02,13.69 29.02,13.76
N$4
  Top 0.15: U1.P$A23 39.14,26.78 40.11,27.75 C2.1 40.03,27.61 40.38,27.26 42.94,27.26 44.4,28.72 44.4,29.76 43.77,30.38 X1.3
N$5
  Top 0.15: 41.56,29.9 41.56,30.87 41.77,31.07 44.26,31.07 44.67,30.66 44.67,28.58 42.32,26.23 39.62,26.23 U1.P$B24 | 41.56,29.9 42.25,29.2 X1.1 | 41.56,29.9 40.66,29.9 40.24,29.48 40.24,29.27 C1.1
N$6
  Top 0.15: C2-EP-DR.1 24.73,16.46 24.73,16.18 23.35,14.8 D4.2 23.28,14.8 19.88,18.19 19.61,18.19 D2.1
N$7
  Top 0.15: U1.P$H23 39.14,24.49 39.41,24.49 39.48,24.56 40.45,24.56 40.52,24.49 L1.1 40.45,24.63 40.59,24.77 40.59,25.32 C3.1
N$8
  Top 0.15: EPD_C10.2 12.89,11.34 12.34,11.34 10.95,12.72 10.67,12.72 J1.22
N$9  (via drill 0.3)
  Top 0.15: v1.88,6.14 1.32,6.14 R3.2 | v3.06,3.79 3.06,4.27 IC3.1
  Bottom 0.15: v1.88,6.14 1.88,4.97 v3.06,3.79
N$10
  Top 0.15: IC9.E1 6.52,28.93 2.99,28.93 2.43,28.37 1.46,28.37 0.7,29.13 0.7,30.1 4.44,33.84 7.97,33.84 9.7,32.11 9.91,32.11 R2.2
N$11
  Top 0.15: EPD_C2.2 12.96,22.14 12.61,21.79 10.67,21.79 J1.4
N$12
  Top 0.15: U1.P$N24 39.62,23.18 40.24,23.18 40.59,22.83 C9.1
N$13  (via drill 0.3)
  Top 0.15: v4.93,29.41 6.52,29.41 IC9.D1 | v9.84,26.99 10.26,26.57 R4.2
  Bottom 0.15: v4.93,29.41 4.93,28.3 6.24,26.99 v9.84,26.99
N$15
  Top 0.15: EPD_C1.2 12.96,20.41 11.78,20.41 10.95,21.24 10.67,21.24 J1.5
N$17
  Top 0.15: R_TYPE_SEL.2 22.79,9.19 22.79,10.16 23.21,10.57 SJ1.2 22.86,9.81 24.59,9.81 R1_EP_DR.1
N$22  (via drill 0.3)
  Top 0.15: v23.14,27.68 22.59,27.68 R2_USB.1 | v21.68,29.96 21.27,29.55 21.27,28.99 J4.B5
  Bottom 0.15: v23.14,27.68 23.14,28.51 v21.68,29.96
N$23
  Top 0.15: R1_USB.2 24.32,27.68 24.32,28.93 J4.A5
N$24
  Top 0.15: EPD_C6.2 12.82,16.46 12.68,16.46 11.02,14.8 10.67,14.8 J1.18
N$25
  Top 0.15: EPD_C7.2 12.82,15.15 11.85,15.15 11.02,14.31 10.67,14.31 J1.19
N$26
  Top 0.15: EPD_C8.2 12.82,13.9 11.09,13.9 10.95,13.76 10.67,13.76 J1.20
N$27  (via drill 0.3)
  Top 0.15: v33.66,27.33 34.15,26.85 34.15,26.5 33.87,26.23 U1.P$B3 | v32.21,27.33 32,27.33 31.59,27.75 31.59,27.89 L2.1
  Bottom 0.15: v32.21,27.33 v33.66,27.33
N$30
  Top 0.15: L2.2 32.07,27.96 32.07,28.93 L3.1
N$31  (via drill 0.3)
  Top 0.15: v37.89,27.2 37.61,26.92 37.61,26.78 U1.P$A18 | v37.89,28.58 37.89,29.55 37.61,29.83 37.61,29.96 C13.1
  Bottom 0.15: v37.89,28.58 v37.89,27.2
N$33
  Top 0.15: EPD_C12.2 12.82,8.71 12.82,9.19 10.67,11.34 10.67,11.68 J1.24
N$46  (via drill 0.2, 0.3, 0.35)
  Top 0.15: v35.88,18.54 35.88,18.4 35.6,18.12 34.77,18.12 34.77,18.15 C20.1 34.29,18.61 34.4,18.72 v34.4,19.4
  Bottom 0.15: U1.P$AC5 34.35,19.45 v34.4,19.4
  other vias: 34.35,20.72
OUT+
  Top 0.15: IC2.A3 8.32,5.59 9.08,5.59 10.6,7.11 TP_OP.TP
OUT-  (via drill 0.3)
  Top 0.15: v8.32,4.07 8.32,4.55 IC2.C3 | v8.32,2.54 8.32,1.85 7.77,1.3 TP_ON.TP
  Bottom 0.15: v8.32,2.54 v8.32,4.07
P0.00/XL1  (via drill 0.3)
  Top 0.15: v33.66,26.71 33.53,26.57 33.53,26.09 33.59,26.02 33.59,25.53 U1.P$D2 | v25.98,24.6 29.16,24.6 X2.1 29.16,24.77 29.72,25.32 29.72,25.95 C17.2
  Bottom 0.15: v33.66,26.71 32.21,26.71 27.78,31.14 26.05,31.14 24.11,29.2 24.11,26.47 v25.98,24.6
P0.01/XL2  (via drill 0.3)
  Top 0.15: v33.11,25.19 33.32,24.98 U1.P$F2 | v28.26,23.04 29.16,22.14 X2.2 29.16,22.07 29.65,21.59 29.65,20.96 C18.2
  Bottom 0.15: v33.11,25.19 33.11,25.39 27.64,30.87 27.02,30.87 26.53,30.38 26.53,29.34 24.39,27.2 24.39,26.92 v28.26,23.04
P0.13/1.5D  (via drill 0.3)
  Top 0.15: v11.64,5.04 11.92,5.31 11.92,5.45 C30.2 | v10.05,5.45 10.47,5.45 10.54,5.38 R5.1 | v9.84,3.79 9.98,3.93 10.54,3.93 SW_UP.2
  Bottom 0.15: 10.47,5.04 v11.64,5.04 | v10.05,5.45 10.47,5.04 | v9.84,3.79 9.84,4.34 10.47,4.97 10.47,5.04
P0.14/1.5D
  Top 0.15: 21.96,5.24 22.38,5.24 22.79,5.66 23.07,5.66 C31.2 | 21.96,5.24 21.55,5.66 R8.1 | 21.96,5.24 21.96,4.34 21.61,4 SW_ENT.2
P1.01/1.6C
  Top 0.15: R_PWR_EPD.1 34.91,13.83 35.05,13.97 35.12,13.97 35.33,14.18 35.33,14.52 34.91,14.94 33.18,14.94 33.04,14.8 33.04,13.14 33.73,12.45 DMG2305UX-7.1
P1.02/1.6C
  Top 0.15: C29.2 33.73,5.45 32.63,5.45 R7.1 32.63,5.38 32.63,4 SW_DN.2
PMIC_INT  (via drill 0.2, 0.35)
  Top 0.15: IC1.A1 13.7,30.8 v13.3,31.2 | v30.6,29 30.6,28.8 v28.3,26.5 | U1.P$T2 33.6,22.17 v33.5,22.07
  Bottom 0.15: v13.3,31.2 13.7,31.2 14,31.5 28.1,31.5 v30.6,29 | v28.3,26.5 28.3,25.7 30.9,23.1 32.7,23.1 33.1,22.7 33.1,22.4 33.43,22.07 v33.5,22.07
PREVGH
  Top 0.15: J1.21 10.67,13.21 11.02,13.21 11.57,12.65 12.82,12.65 EPD_C9.2 12.89,12.58 13.51,11.96 14.62,11.96 15.04,12.38 22.65,12.38 24.39,14.11 25.15,14.11 D5.1
PREVGL
  Top 0.15: J1.23 10.67,12.24 10.95,12.24 12.89,10.3 12.89,10.02 EPD_C11.2 12.96,9.95 13.44,9.47 14,9.47 14.99,8.47 25.26,8.47 26.74,9.95 26.74,13.9 25.84,14.8 24.52,14.8 24.32,14.59 24.32,14.45 23.97,14.11 22.45,14.11 18.78,17.78 18.78,18.75 18.91,18.89 20.23,18.89 20.85,18.26 D2.2
RESE  (via drill 0.3)
  Top 0.15: 25.29,10.37 25.98,10.37 Q3.2 | 25.29,10.37 24.66,10.37 R1_EP_DR.2 | v12.4,22.28 10.67,22.28 J1.3 | 25.29,10.37 v25.29,10.92
  Bottom 0.15: v12.4,22.28 13.93,22.28 v25.29,10.92
RESET  (via drill 0.2, 0.3)
  Top 0.15: v40.24,9.88 40.73,10.37 40.87,10.37 J2.6 | v34.63,9.47 34.36,9.47 33.53,8.64 TP_RESET.TP
  Bottom 0.15: v40.24,9.88 39.55,9.88 39.48,9.95 38.79,9.95 38.3,9.47 36.1,9.47 | v34.63,9.47 36.1,9.47 | 36.1,9.47 36.1,17.3 36.4,17.6 36.4,20.67 U1.P$AC13
  other vias: 36.35,20.72
RF
  Top 0.15: L1.2 41.14,24.49 41.14,24.7 41.77,25.32 C4.1 41.84,25.39 42.88,25.39 C22.1 42.94,25.32 43.57,25.32 44.81,24.08 ANT1.1
SCL/1.4C  (via drill 0.3)
  Top 0.15: IC2.C1 7.13,4.72 v6.39,4.72 | U3.7 16.56,26.02 16.84,26.02 17.11,26.3 17.11,27.19 16.8,27.5 14.58,27.5 v14.17,27.09
  Bottom 0.15: v6.39,4.72 6.39,8.65 10.88,13.14 10.88,23.8 v14.17,27.09
SCL/2.4C  (via drill 0.2, 0.3, 0.35)
  Top 0.15: 2.36,5.04 2.71,5.04 2.85,4.9 2.99,4.9 IC3.12 | 2.36,5.04 1.39,5.04 R17.2 | v13.17,30.45 13.51,30.1 13.65,30.1 IC1.B1 | v11.23,32.39 10.26,33.36 TP_SCL.TP | 11.26,26.74 11.78,27.26 v11.78,29.13 | 11.26,26.74 11.09,26.57 10.88,26.57 R4.1 | 11.26,26.74 v11.37,26.64 | v2.36,5.1 2.36,5.04 | v29.8,30.5 29.8,28.7 v28.6,27.5
  Bottom 0.15: 12.31,31.31 v11.23,32.39 11.16,32.39 10.67,31.9 10.67,31.63 11.78,30.52 v11.78,29.13 | 12.31,31.31 v13.17,30.45 | v2.36,5.1 2.36,6.77 5.55,9.95 7.28,9.95 10.6,13.28 10.6,25.88 v11.37,26.64 | 12.31,31.31 12.9,31.9 28.4,31.9 v29.8,30.5 | v28.6,27.5 32.63,23.47 U1.P$M2
  other vias: 33.6,23.47
SDA/1.4C  (via drill 0.2, 0.35)
  Top 0.15: v26.9,7.6 v13.6,7.6 | v16.9,23.3 17.3,23.7 v19.4,23.7 | U3.8 16.5,26.89 v16.6,27 | v28.2,11.9 v27.2,12.9
  Bottom 0.15: IC2.B2 10.31,7.6 v13.6,7.6 | v16.9,23.3 16.9,20.5 24.5,12.9 v27.2,12.9 | v19.4,23.7 20.1,24.4 20.1,25.5 18.6,27 v16.6,27 | v26.9,7.6 29.5,10.2 29.5,11.4 29,11.9 v28.2,11.9
  other vias: 7.78,5.07
SDA/2.4C  (via drill 0.3)
  Top 0.15: v1.88,3.58 1.46,4 R18.2 | v3.61,4.9 3.61,4.34 IC3.2 | v1.32,7.18 1.32,8.22 1.6,8.5 TP_SDA.TP | v13.24,29.69 13.65,29.69 IC1.C1 | v11.16,31.77 10.81,31.77 10.54,32.04 R2.1 | v32.11,21.24 32.11,23.01 32.76,23.66 33.04,23.66 U1.P$L1
  Bottom 0.15: v3.61,4.9 3.61,3.72 3.2,3.3 2.92,3.3 2.64,3.58 v1.88,3.58 1.88,4.55 1.32,5.1 v1.32,7.18 2.36,7.18 5.41,10.23 7.14,10.23 10.33,13.41 10.33,26.23 12.99,28.89 | v11.16,31.77 v13.24,29.69 13.24,29.34 13.34,29.24 12.99,28.89 | v32.11,21.24 32.11,19.06 31.17,18.12 23.75,18.12 12.99,28.89
SWDCLK  (via drill 0.3)
  Top 0.15: v40.11,21.45 39.9,21.24 39.62,21.24 U1.P$AA24 | J2.4 40.94,11.68 41.7,12.45 v41.91,12.45 41.97,12.45 42.11,12.58 43.43,12.58 44.33,11.68 44.33,10.37 42.39,8.43 42.39,3.37 TP_SWDCLK.TP
  Bottom 0.15: v40.11,21.45 41.28,20.27 41.28,13.07 v41.91,12.45
SWDIO  (via drill 0.3)
  Top 0.15: v40.11,20.82 40.03,20.75 39.62,20.75 U1.P$AC24 | v40.11,19.79 41.7,18.19 TP_SWDIO.TP | v38.86,12.86 39.41,12.31 39.9,12.31 40.52,12.93 40.87,12.93 J2.2
  Bottom 0.15: v40.11,20.82 v40.11,19.79 40.17,19.79 40.17,18.54 39.41,17.78 39.41,13.69 38.86,13.14 v38.86,12.86
SWO
  Top 0.15: U1.P$AD22 38.65,20.27 39,20.62 39.27,20.62 39.55,20.34 41.42,20.34 41.77,20.69 TP_SWO.TP
VBAT/1.2A
  Top 0.3: C27.2 14.44,26.05 U3.2 U3.3 14.44,25.37 14.05,25.37 13.2,24.52 13.2,24.1 13.6,23.7 15.5,23.7 17.27,21.93 TP_VBAT.TP
VBAT/2.5C
  Top 0.3: IC1.C2 15.97,29.68 C37.2
VBUS/1.5D
  Top 0.15: 25.4,26.69 C42.1 24.6,26.2
  Top 0.3: 21.9,25.98 D3.5 | 21.9,25.98 22.94,25.98 C43.1 23.82,26.6 24.2,26.6 24.6,26.2 | J4.A9_B4 20.6,28.2 20.9,27.9 21.7,27.9 21.9,27.7 21.9,25.98 | J4.A4_B9 25.4,26.69
VBUS/2.6D  (via drill 0.35)
  Top 0.15: 14.1,31.21 IC1.A2 14.52,30.9
  Top 0.3: C38.2 14.1,31.21 | U1.P$AD2 33.6,20.03 C21.1 31.05,18.65 v31,18.6 | 14.52,30.9 v15.1,30.9
  Bottom 0.3: v15.1,30.9 15.5,30.5 15.5,28.1 15.7,27.9 22.1,27.9 22.1,21 22.4,20.7 27.7,20.7 29.8,18.6 v31,18.6
VREG
  Top 0.15: IC1.B2 14.78,30.08 15,30.3 | 16.46,31.26 C39.1
  Top 0.3: IC9.A1 5.72,30.58 5.5,30.8 4.41,30.8 C23.2 3.09,30.79 TP_VREG.TP | IC9.A1 6.55,31.45 6.7,31.6 C24.2 | IC9.A1 IC9.A2 IC9.A3 7.97,31.2 11.6,31.2 12,31.6 12,33.2 12.4,33.6 15.1,33.6 15.65,33.05 15.65,30.45 | 15,30.3 15.5,30.3 15.65,30.45 | 15.65,30.45 16.46,31.26
(copper drawn outside any net)
  shapes: Bottom area x1, Top area x1